# EAGLE design MacawBlue Thing Plus (EAGLE 9.6.2)

## Sheet 1 of 2
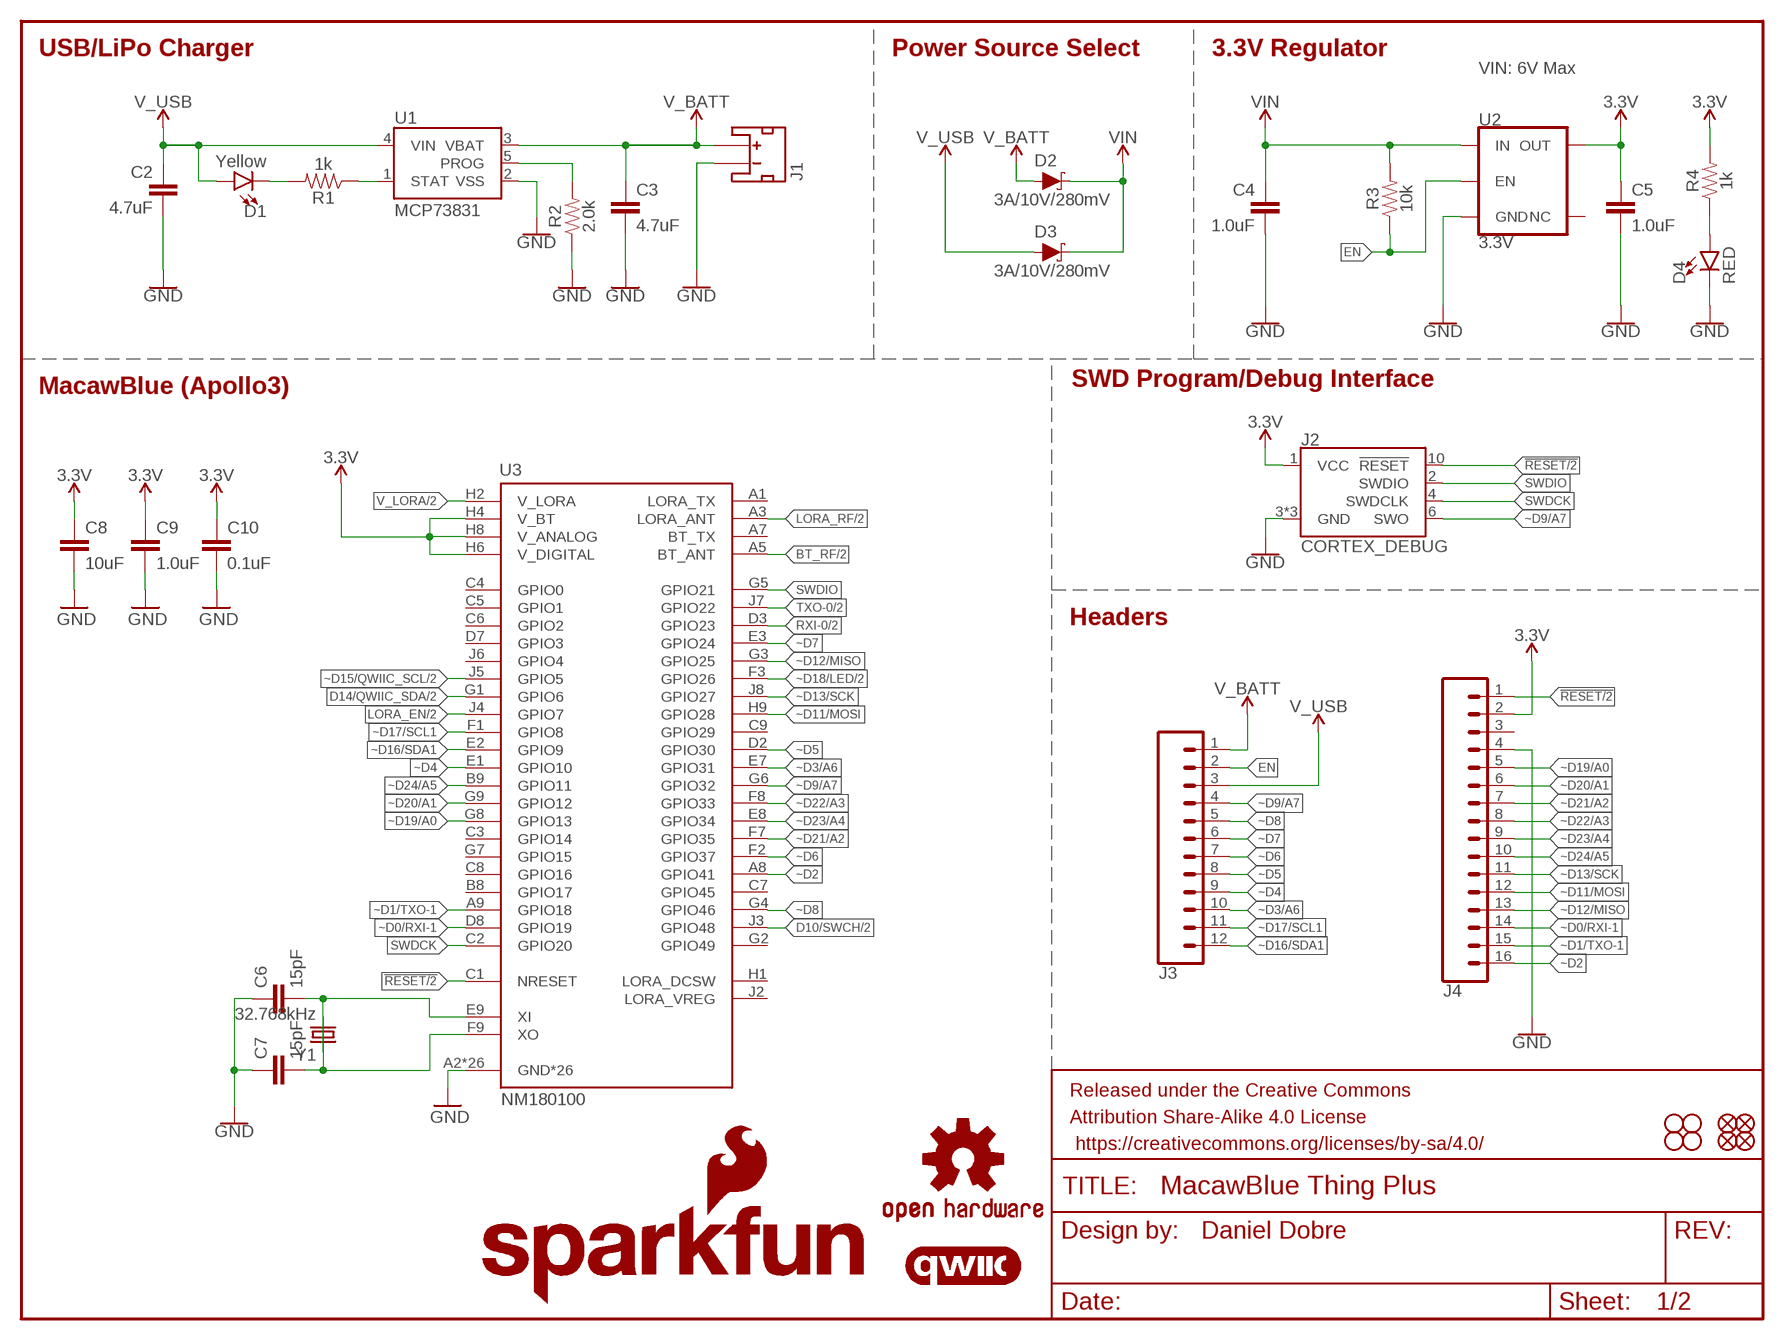
[diagram p0: schematic, sheet 1]

### Parts
C2  4.7uF  4.7UF-0603-6.3V-(10%)  [0603]
C3  4.7uF  4.7UF-0603-6.3V-(10%)  [0603]
C4  1.0uF  1.0UF-0402T-16V-10%  [0402-TIGHT]
C5  1.0uF  1.0UF-0402T-16V-10%  [0402-TIGHT]
C6  15pF  15PF-0603-50V-5%  [0603]
C7  15pF  15PF-0603-50V-5%  [0603]
C8  10uF  10UF-0603-6.3V-20%  [0603]
C9  1.0uF  1.0UF-0603-16V-10%  [0603]
C10  0.1uF  0.1UF-0603-25V-(+80/-20%)  [0603]
D1  Yellow  LED-YELLOW0603  [LED-0603]
D2  3A/10V/280mV  DIODE-SCHOTTKY-BAT60A  [SOD-323]
D3  3A/10V/280mV  DIODE-SCHOTTKY-BAT60A  [SOD-323]
D4  RED  LED-RED0603  [LED-0603]
FD1  FIDUCIALUFIDUCIAL  [FIDUCIAL-MICRO]
FD2  FIDUCIALUFIDUCIAL  [FIDUCIAL-MICRO]
FD3  FIDUCIALUFIDUCIAL  [FIDUCIAL-MICRO]
FD4  FIDUCIALUFIDUCIAL  [FIDUCIAL-MICRO]
FRAME1  FRAME-LETTER  [CREATIVE_COMMONS]
H1  STAND-OFF  [STAND-OFF]
H2  STAND-OFF  [STAND-OFF]
H3  STAND-OFF  [STAND-OFF]
H4  STAND-OFF  [STAND-OFF]
J1  JST_2MM_MALE  [JST-2-SMD]
J2  CORTEX_DEBUG  CORTEX_DEBUG_MINIMUM_PTH_NS  [2X5-PTH-1.27MM-NO_SILK]
J3  CONN_12SM_SQ_NO_SILK  [1X12_SM_SQ_NOSILK]
J4  CONN_161X16_SM_SQ_NOSILK  [1X16_SM_SQ_NOSILK]
LOGO1  OSHW-LOGOS  [OSHW-LOGO-S]
LOGO2  QWIIC_LOGO_5MM  [QWIIC_5MM]
LOGO3  SFE_LOGO_NAME_FLAME.1_INCH  [SFE_LOGO_NAME_FLAME_.1]
R1  1k  1KOHM-0603-1/10W-1%  [0603]
R2  2.0k  2.0KOHM-0603-1/10W-5%  [0603]
R3  10k  10KOHM-0603-1/10W-1%  [0603]
R4  1k  1KOHM-0603-1/10W-1%  [0603]
U1  MCP73831  [SOT23-5]
U2  3.3V  V_REG_AP2112K-3.3V  [SOT23-5]
U3  NM180100  [LGA81]
Y1  32.768kHz  CRYSTAL-32.768KHZSMD-3.2X1.5  [CRYSTAL-SMD-3.2X1.5MM]

### Nets
3.3V: C5.1 C8.1 C9.1 C10.1 J2.1(VCC) J4.2 R4.2 U2.5(OUT) U3.H4(V_BT) U3.H6(V_DIGITAL) U3.H8(V_ANALOG) ; also sheet 2
!RESET: J2.10(!RESET) J4.1 U3.C1(NRESET) ; also sheet 2
BT_RF: U3.A5(BT_ANT) ; also sheet 2
D10/SWCH: U3.J3(GPIO48) ; also sheet 2
D14/QWIIC_SDA: U3.G1(GPIO6) ; also sheet 2
EN: J3.2 R3.1 U2.3(EN)
GND: C2.2 C3.2 C4.2 C5.2 C6.1 C7.1 C8.2 C9.2 C10.2 D4.C J1.1(-) J2.3(GND) J2.5(GND) J2.9(GND) J4.4 R2.1 U1.2(VSS) U2.2(GND) U3.A2(GND*26) U3.A4(GND*26) U3.A6(GND*26) U3.B1(GND*26) U3.B2(GND*26) U3.B3(GND*26) U3.B4(GND*26) U3.B5(GND*26) U3.B6(GND*26) U3.B7(GND*26) U3.D1(GND*26) U3.D4(GND*26) U3.D5(GND*26) U3.D6(GND*26) U3.D9(GND*26) U3.E4(GND*26) U3.E5(GND*26) U3.E6(GND*26) U3.F4(GND*26) U3.F5(GND*26) U3.F6(GND*26) U3.H3(GND*26) U3.H5(GND*26) U3.H7(GND*26) U3.J1(GND*26) U3.J9(GND*26) ; also sheet 2
LORA_EN: U3.J4(GPIO7) ; also sheet 2
LORA_RF: U3.A3(LORA_ANT) ; also sheet 2
N$1: R2.2 U1.5(PROG)
N$2: C7.2 U3.F9(XO) Y1.P$2
N$3: D1.C R1.2
N$4: R1.1 U1.1(STAT)
N$8: C6.2 U3.E9(XI) Y1.P$1
N$10: D4.A R4.1
RXI-0: U3.D3(GPIO23) ; also sheet 2
SWDCK: J2.4(SWDCLK) U3.C2(GPIO20)
SWDIO: J2.2(SWDIO) U3.G5(GPIO21)
TXO-0: U3.J7(GPIO22) ; also sheet 2
V_BATT [power]: C3.1 D2.A J1.2(+) J3.1 U1.3(VBAT)
V_LORA: U3.H2(V_LORA) ; also sheet 2
V_USB: C2.1 D1.A D3.A J3.3 U1.4(VIN) ; also sheet 2
VIN: C4.1 D2.C D3.C R3.2 U2.1(IN) ; also sheet 2
~D0/RXI-1: J4.14 U3.D8(GPIO19)
~D1/TXO-1: J4.15 U3.A9(GPIO18)
~D2: J4.16 U3.A8(GPIO41)
~D3/A6: J3.10 U3.E7(GPIO31)
~D4: J3.9 U3.E1(GPIO10)
~D5: J3.8 U3.D2(GPIO30)
~D6: J3.7 U3.F2(GPIO37)
~D7: J3.6 U3.E3(GPIO24)
~D8: J3.5 U3.G4(GPIO46)
~D9/A7: J2.6(SWO) J3.4 U3.G6(GPIO32)
~D11/MOSI: J4.12 U3.H9(GPIO28)
~D12/MISO: J4.13 U3.G3(GPIO25)
~D13/SCK: J4.11 U3.J8(GPIO27)
~D15/QWIIC_SCL: U3.J5(GPIO5) ; also sheet 2
~D16/SDA1: J3.12 U3.E2(GPIO9)
~D17/SCL1: J3.11 U3.F1(GPIO8)
~D18/LED: U3.F3(GPIO26) ; also sheet 2
~D19/A0: J4.5 U3.G8(GPIO13)
~D20/A1: J4.6 U3.G9(GPIO12)
~D21/A2: J4.7 U3.F7(GPIO35)
~D22/A3: J4.8 U3.F8(GPIO33)
~D23/A4: J4.9 U3.E8(GPIO34)
~D24/A5: J4.10 U3.B9(GPIO11)
Unconnected: J1.NC1(PAD1) J1.NC2(PAD2) J4.3 U2.4(NC) U3.A1(LORA_TX) U3.A7(BT_TX) U3.B8(GPIO17) U3.C3(GPIO14) U3.C4(GPIO0) U3.C5(GPIO1) U3.C6(GPIO2) U3.C7(GPIO45) U3.C8(GPIO16) U3.C9(GPIO29) U3.D7(GPIO3) U3.G2(GPIO49) U3.G7(GPIO15) U3.H1(LORA_DCSW) U3.J2(LORA_VREG) U3.J6(GPIO4)

### Notes on the sheet
- USB/LiPo Charger | Power Source Select | 3.3V Regulator
- VIN: 6V Max
- MacawBlue (Apollo3) | SWD Program/Debug Interface
- Headers
- Daniel Dobre

## Sheet 2 of 2
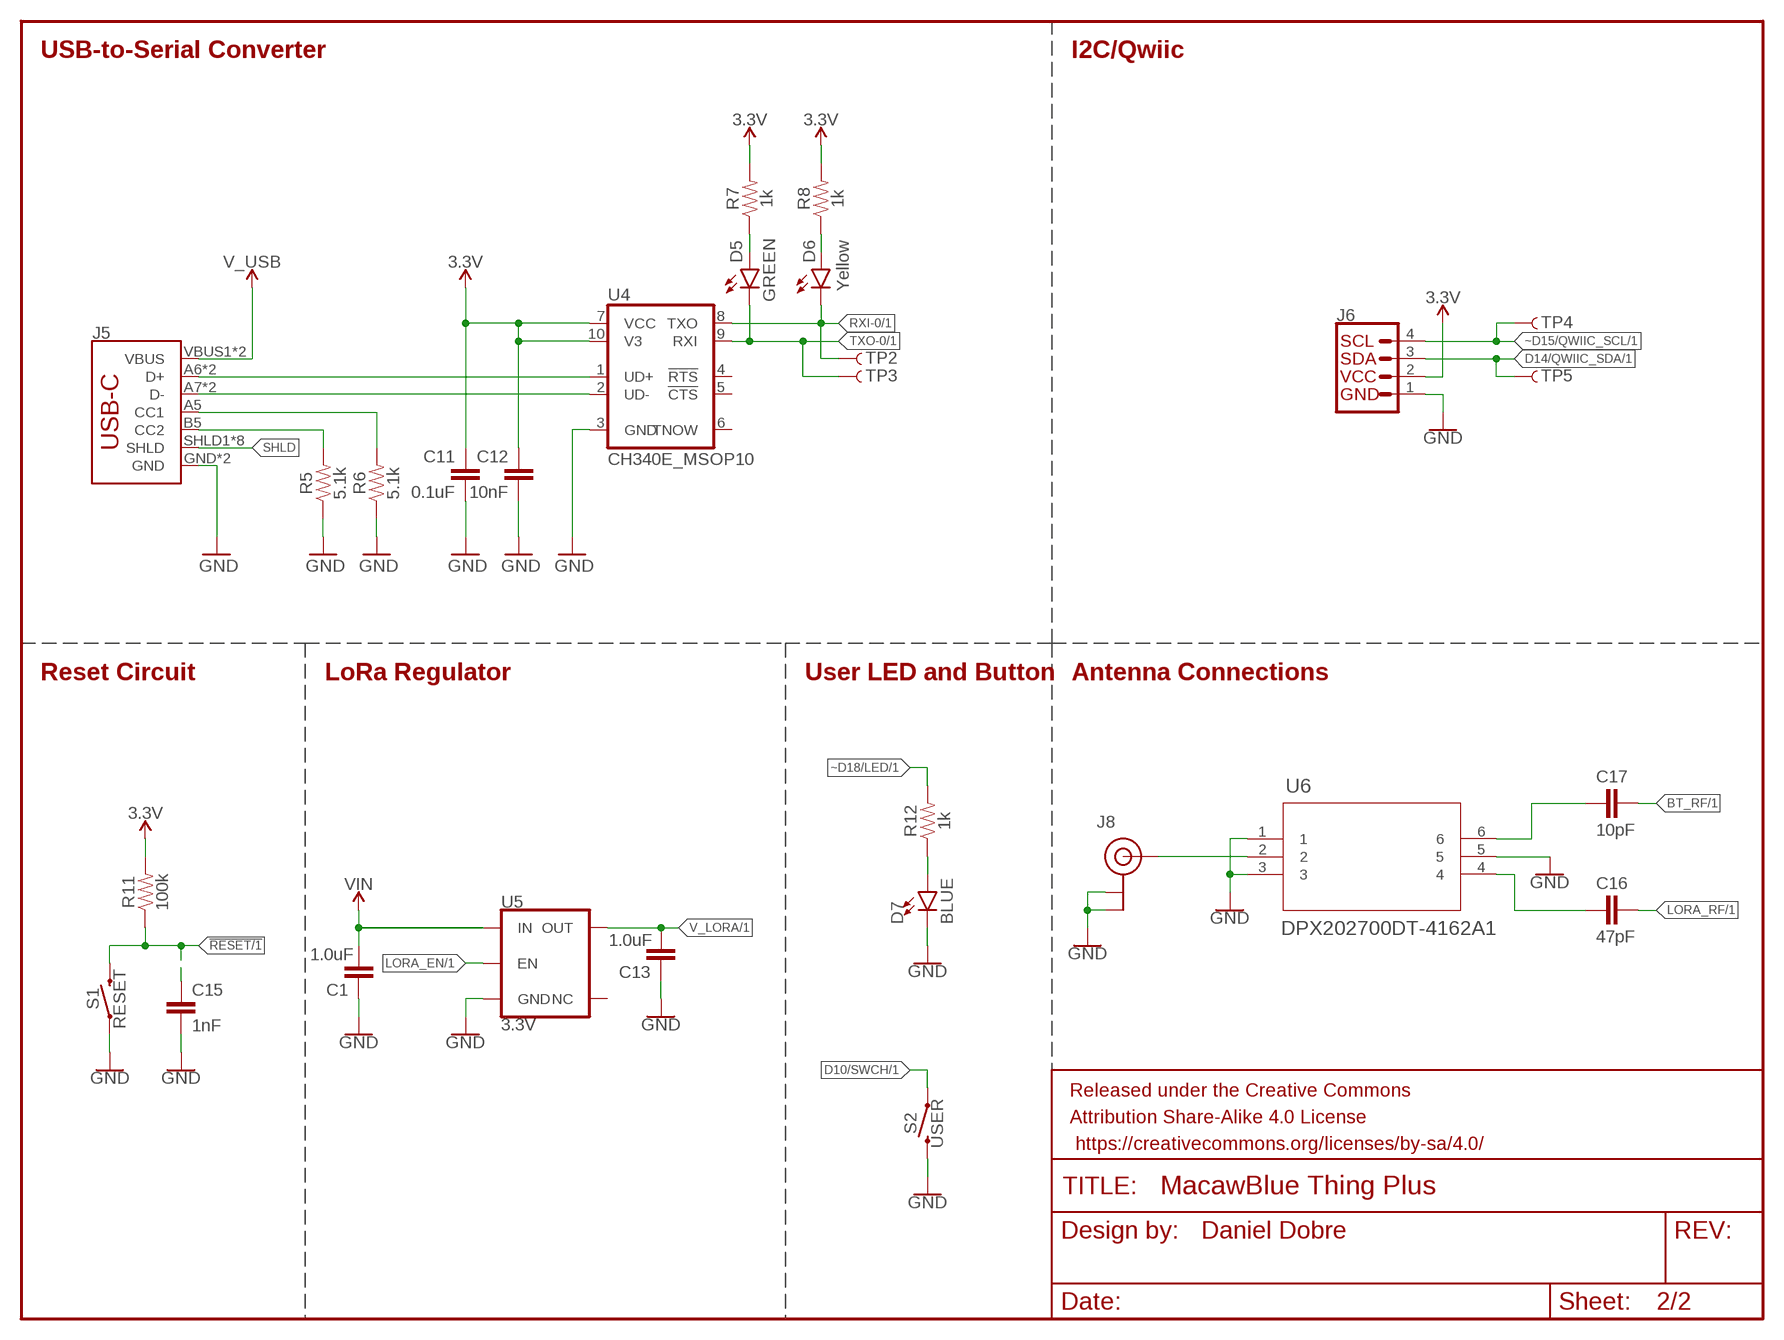
[diagram p1: schematic, sheet 2]

### Parts
C1  1.0uF  1.0UF-0402T-16V-10%  [0402-TIGHT]
C11  0.1uF  0.1UF-0603-25V-(+80/-20%)  [0603]
C12  10nF  10NF-0603-50V-10%  [0603]
C13  1.0uF  1.0UF-0402T-16V-10%  [0402-TIGHT]
C15  1nF  1.0NF/1000PF-0603-50V-10%  [0603]
C16  47pF  47PF-0603-50V-5%  [0603]
C17  10pF  10PF-0603-50V-5%  [0603]
D5  GREEN  LED-GREEN0603  [LED-0603]
D6  Yellow  LED-YELLOW0603  [LED-0603]
D7  BLUE  LED-BLUE0603  [LED-0603]
FRAME2  FRAME-LETTERNO_PACKAGE  [DUMMY]
J5  USB-C  USB_C2-LAYER  [USB-C-16P]
J6  QWIIC_CONNECTORJS-1MM  [JST04_1MM_RA]
J8  U.FL  [U.FL]
R5  5.1k  5.1KOHM5.1KOHM-0603-1/10W-1%  [0603]
R6  5.1k  5.1KOHM5.1KOHM-0603-1/10W-1%  [0603]
R7  1k  1KOHM-0603-1/10W-1%  [0603]
R8  1k  1KOHM-0603-1/10W-1%  [0603]
R11  100k  100KOHM-0603-1/10W-1%  [0603]
R12  1k  1KOHM-0603-1/10W-1%  [0603]
S1  RESET  MOMENTARY-SWITCH-SPST-SMD-4.6X2.8MM  [TACTILE_SWITCH_SMD_4.6X2.8MM]
S2  USER  MOMENTARY-SWITCH-SPST-SMD-4.6X2.8MM  [TACTILE_SWITCH_SMD_4.6X2.8MM]
TP2  TEST-POINTTP_15TH_THRU  [TP_15TH]
TP3  TEST-POINTTP_15TH_THRU  [TP_15TH]
TP4  TEST-POINTTP_15TH_THRU  [TP_15TH]
TP5  TEST-POINTTP_15TH_THRU  [TP_15TH]
U4  CH340E_MSOP10  [MSOP10]
U5  3.3V  V_REG_AP2112K-3.3V  [SOT23-5]
U6  DPX202700DT-4162A1  [RF_4060A1_TDK]

### Nets
3.3V: C11.1 C12.1 J6.2 R7.2 R8.2 R11.2 U4.7(VCC) U4.10(V3) ; also sheet 1
!RESET: C15.1 R11.1 S1.3 S1.4 ; also sheet 1
BT_RF: C17.1 ; also sheet 1
CC1: J5.A5(CC1) R6.2
CC2: J5.B5(CC2) R5.2
D10/SWCH: S2.1 S2.2 ; also sheet 1
D14/QWIIC_SDA: J6.3 TP5.P$1 ; also sheet 1
D+1: J5.A6(D+) J5.B6(D+) U4.1(UD+)
D-1: J5.A7(D-) J5.B7(D-) U4.2(UD-)
GND: C1.1 C11.2 C12.2 C13.1 C15.2 D7.C J5.GND J5.GND2(GND) J6.1 J8.1(GND) J8.2(GND) R5.1 R6.1 S1.1 S1.2 S2.3 S2.4 U4.3(GND) U5.2(GND) U6.1 U6.3 U6.5 ; also sheet 1
LORA_EN: U5.3(EN) ; also sheet 1
LORA_RF: C16.1 ; also sheet 1
N$5: D5.A R7.1
N$7: D7.A R12.1
N$9: D6.A R8.1
N$11: C17.2 U6.6
N$12: J8.FEED(SIGNAL) U6.2
N$13: C16.2 U6.4
RXI-0: D6.C TP2.P$1 U4.8(TXO) ; also sheet 1
SHLD: J5.SHLD1(SHLD) J5.SHLD2(SHLD) J5.SHLD3(SHLD) J5.SHLD4(SHLD) J5.SHLD5(SHLD) J5.SHLD6(SHLD) J5.SHLD7(SHLD) J5.SHLD8(SHLD)
TXO-0: D5.C TP3.P$1 U4.9(RXI) ; also sheet 1
V_LORA: C13.2 U5.5(OUT) ; also sheet 1
V_USB: J5.VBUS1(VBUS) J5.VBUS2(VBUS) ; also sheet 1
VIN: C1.2 U5.1(IN) ; also sheet 1
~D15/QWIIC_SCL: J6.4 TP4.P$1 ; also sheet 1
~D18/LED: R12.2 ; also sheet 1
Unconnected: U4.4(!RTS) U4.5(!CTS) U4.6(TNOW) U5.4(NC)

### Notes on the sheet
- USB-to-Serial Converter | I2C/Qwiic
- Reset Circuit | LoRa Regulator | User LED and Button | Antenna Connections
- Daniel Dobre

## Library data of the parts
C1 C4 C5 C13 = SparkFun-Capacitors:1.0UF: 1µF ceramic capacitors A capacitor is a passive two-terminal electrical component used to store electrical energy temporarily in an electric field.; PROD_ID: CAP-12417
C2 C3 = SparkFun-Capacitors:4.7UF: 4.7µF ceramic capacitors A capacitor is a passive two-terminal electrical component used to store electrical energy temporarily in an electric field.; PROD_ID: CAP-08280
C6 C7 = SparkFun-Capacitors:15PF: 15pF ceramic capacitors A capacitor is a passive two-terminal electrical component used to store electrical energy temporarily in an electric field.; PROD_ID: CAP-07881
C8 = SparkFun-Capacitors:10UF: 10.0µF ceramic capacitors A capacitor is a passive two-terminal electrical component used to store electrical energy temporarily in an electric field.; PROD_ID: CAP-11015
C9 = SparkFun-Capacitors:1.0UF: 1µF ceramic capacitors A capacitor is a passive two-terminal electrical component used to store electrical energy temporarily in an electric field.; PROD_ID: CAP-00868
C10 C11 = SparkFun-Capacitors:0.1UF: 0.1µF ceramic capacitors A capacitor is a passive two-terminal electrical component used to store electrical energy temporarily in an electric field.; PROD_ID: CAP-00810
C12 = SparkFun-Capacitors:10NF: 0.01uF/10nF/10,000pF ceramic capacitors A capacitor is a passive two-terminal electrical component used to store electrical energy temporarily in an electric field. CAP-09321; PROD_ID: CAP-00867
C15 = SparkFun-Capacitors:1.0NF/1000PF: 1nF/1,000pF ceramic capacitors A capacitor is a passive two-terminal electrical component used to store electrical energy temporarily in an electric field.; PROD_ID: CAP-07886
C16 = SparkFun-Capacitors:47PF: 47pF ceramic capacitors A capacitor is a passive two-terminal electrical component used to store electrical energy temporarily in an electric field.; PROD_ID: CAP-08913
C17 = SparkFun-Capacitors:10PF: 10pF ceramic capacitors A capacitor is a passive two-terminal electrical component used to store electrical energy temporarily in an electric field.; PROD_ID: CAP-11812
D1 D6 = SparkFun-LED:LED-YELLOW: Yellow SMD LED Used in manufacturing several products at SparkFun. Packages: 0603 - SMD 0603 package[Product Link] <http://www.kingbrightusa.com/product.asp?catalog_name=LED&product_id=APT1608SYCK> 0603 -SMART - SMART SMD 0603 package (more efficient/more expensive) [Product Link] <http://www.osram-os.com/osram_os/en/products/product-catalog/led-light-emitting-diodes/smartled-0603/ly-l29k/index.jsp> LilyPad - SMD1206 package[Product Datasheet] <https://www.sparkfun.com/datasheets/DevTools/LilyPad/Q150YUS4.pdf> SparkFun Products: Blynk Board <https://www.sparkfun.com/products/13794> IOIO-OTG <https://www.sparkfun.com/products/13613> XBee Explorer Serial <https://www.sparkfun.com/products/13225>; PROD_ID: DIO-09003
D2 D3 = SparkFun-DiscreteSemi:DIODE-SCHOTTKY: Schottky diode A Schottky diode is a semiconductor diode which has a low forward voltage drop and a very fast switching action.; PROD_ID: DIO-14072
D4 = SparkFun-LED:LED-RED: Red SMD LED Used in manufacturing of most products at SparkFun Packages: 0603 - SMD 0603 package [Product Link] <http://docs.avagotech.com/docs/AV02-0551EN> 0603 SMART - SMD 0603 SMART package ( more efficient and expensive)[Product Link] <http://www.osram-os.com/Graphics/XPic2/00077099_0.pdf> 1206 - SMD1206 package [Product Link] <https://www.sparkfun.com/datasheets/DevTools/LilyPad/Q150OVS4.pdff> SparkFun Products: Pro Mini 328 -5V <https://www.sparkfun.com/products/821> RedBoard <https://www.sparkfun.com/products/12757> IOIO-OTG <https://www.sparkfun.com/products/13613>; PROD_ID: DIO-00819
D5 = SparkFun-LED:LED-GREEN: Green SMD LED Used in manufacturing of various products at SparkFun Packages: 0603 - SMD 0603 package [Product Link] <http://www.futureelectronics.com/en/technologies/semiconductors/optoelectronics/leds/Pages/9894312-LTST-C190GKT.aspx?CrossPart=HSMG-C190&IM=0> LilyPad 1206 - SMD1206 LilyPad package [Product Link] <http://www.futureelectronics.com/en/Technologies/Product.aspx?ProductID=IN150NGHARVATEKCORPORATION2049943&IM=0> 1206 - SMD1206 package [Product Link] <http://www.futureelectronics.com/en/technologies/semiconductors/optoelectronics/leds/Pages/8315665-LTST-C150KGKT.aspx?IM=0> 1206 Bottom Mount -SMD 1206 Bottom Mount [Product Link] <http://www.digikey.com/product-detail/en/lite-on-inc/LTST-C230KGKT/160-1456-1-ND/386854> SparkFun Products: Pro Mini 328 -5V <https://www.sparkfun.com/products/821> RedBoard <https://www.sparkfun.com/products/12757> MP3 Trigger <https://www.sparkfun.com/products/13720> Makey Makey <https://www.sparkfun.com/products/11076>; PROD_ID: DIO-00821
D7 = SparkFun-LED:LED-BLUE: Blue SMD LED Used in manufacturing of various products at SparkFun Packages: 0603 - SMD 0603 package [Product Link] <http://www.digikey.com/product-detail/en/SMLE12BC7TT86/511-1589-2-ND/1641808> 1206 - SMD1206 package [Product Link] <http://www.digikey.com/product-detail/en/lite-on-inc/LTST-C150TBKT/160-1643-1-ND/573584> SparkFun Products: ESP8266 Thing-Dev Board <https://www.sparkfun.com/products/13711> RedBoard <https://www.sparkfun.com/products/12757>; PROD_ID: DIO-08575
FD1-FD4 = SparkFun-Aesthetics:FIDUCIAL: Fiducial Alignment Points Point-of-reference for pick-and-place machines and other optical instruments.
FRAME1 = SparkFun-Aesthetics:FRAME-LETTER: Schematic Frame - Letter Standard 8.5x11 US Letter frame
FRAME2 = SparkFun-Aesthetics:FRAME-LETTER: Schematic Frame - Letter Standard 8.5x11 US Letter frame; DESIGNER: Nobody; VERSION: v01
H1-H4 = SparkFun-Hardware:STAND-OFF: Stand Off Drill holes for mechanically mounting via screws, standoffs, etc. Note: Use the keepout ring to avoid running the screw head into surrounding components. Variant Overviews STAND-OFF - Mechanical footprint for a #4 phillips button head screw. STAND-OFF-TIGHT - Mechanical footprint for a #4 phillips button head screw, Example SparkFun Products Screw - Phillips Head (1/4", 4-40, 10 pack) <https://www.sparkfun.com/products/10453> (PRT-10453) Screw - Phillips Head (1/2", 4-40, 10 pack) <https://www.sparkfun.com/products/10452> (PRT-10452) Screw - Phillips Head (3/4", 4-40, 10 pack) <https://www.sparkfun.com/products/10451> (PRT-10451) Screw - Phillips Head (1", 4-40, 10 pack) <https://www.sparkfun.com/products/10450> (PRT-10450)
J1 = SparkFun-Connectors:JST_2MM_MALE: JST 2MM MALE RA CONNECTOR Two pin, compact surface mount connector. Commonly used as a battery input connection point. We really like the solid locking feeling and high current rating on these small connectors. We use these all the time as battery connectors. Mates to single-cell LiPo batteries. Here is the connector we sell at SparkFun: JST Right Angle Connector - White <https://www.sparkfun.com/products/8612> (PRT-08612) Datasheet <http://www.sparkfun.com/datasheets/Prototyping/Connectors/JST-Horizontal.pdf> It was used on these SparkFun products: SparkFun MOSFET Power Controller <https://www.sparkfun.com/products/11214> (PRT-11214) SparkFun Battery Babysitter - LiPo Battery Manager <https://www.sparkfun.com/products/13777> (PRT-13777) And many, many others that required a lipo battery connection.; PROD_ID: CONN-11443; SF_ID: PRT-08612
J2 = SparkFun-Connectors:CORTEX_DEBUG_MINIMUM: Cortex Debug Connector - 10 pin Supports JTAG debug, Serial Wire debug, and Serial Wire Viewer. PTH and SMD connector options available. General Connector Information <http://infocenter.arm.com/help/topic/com.arm.doc.faqs/attached/13634/cortex_debug_connectors.pdf> Products: PTH Connector <http://www.digikey.com/product-detail/en/cnc-tech/3220-10-0100-00/1175-1627-ND/3883661> -via Digi-Key SparkFun PSoc <https://www.sparkfun.com/products/13229> SparkFun T <https://www.sparkfun.com/products/13810>
J3 = SparkFun-Connectors:CONN_12: Multi connection point. Often used as Generic Header-pin footprint for 0.1 inch spaced/style header connections On any of the 0.1 inch spaced packages, you can populate with these: Break Away Headers - Straight <https://www.sparkfun.com/products/116> (PRT-00116) Break Away Male Headers - Right Angle <https://www.sparkfun.com/products/553> (PRT-00553) Female Headers <https://www.sparkfun.com/products/115> (PRT-00115) Break Away Headers - Machine Pin <https://www.sparkfun.com/products/117> (PRT-00117) Break Away Female Headers - Swiss Machine Pin <https://www.sparkfun.com/products/743> (PRT-00743) For SCREWTERMINALS and SPRING TERMINALS visit here: Screw Terimnals on SparkFun.com <https://www.sparkfun.com/search/results?term=Screw+Terminals> (5mm/3.5mm/2.54mm spacing) This device is also useful as a general connection point to wire up your design to another part of your project. Our various solder wires solder well into these plated through hole pads. Hook-Up Wire - Assortment (Stranded, 22 AWG) <https://www.sparkfun.com/products/11375> (PRT-11375) Hook-Up Wire - Assortment (Solid Core, 22 AWG) <https://www.sparkfun.com/products/11367> (PRT-11367) View the entire wire category on our website here <https://www.sparkfun.com/categories/141> Special notes: Molex polarized connector foot print use with SKU : PRT-08231 with associated crimp pins and housings. 1MM SMD Version SKU: PRT-10208 NOTES ON THE VARIANTS LOCK and LOCK_LONGPADS... This footprint was designed to help hold the alignment of a through-hole component (i.e. 6-pin header) while soldering it into place. You may notice that each hole has been shifted either up or down by 0.005 of an inch from it's more standard position (which is a perfectly straight line). This slight alteration caused the pins (the squares in the middle) to touch the edges of the holes. Because they are alternating, it causes a "brace" to hold the component in place. 0.005 has proven to be the perfect amount of "off-center" position when using our standard breakaway headers. Although looks a little odd when you look at the bare footprint, once you have a header in there, the alteration is very hard to notice. Also,if you push a header all the way into place, it is covered up entirely on the bottom side.
J4 = SparkFun-Connectors:CONN_16: Multi connection point. Often used as Generic Header-pin footprint for 0.1 inch spaced/style header connections On any of the 0.1 inch spaced packages, you can populate with these: Break Away Headers - Straight <https://www.sparkfun.com/products/116> (PRT-00116) Break Away Male Headers - Right Angle <https://www.sparkfun.com/products/553> (PRT-00553) Female Headers <https://www.sparkfun.com/products/115> (PRT-00115) Break Away Headers - Machine Pin <https://www.sparkfun.com/products/117> (PRT-00117) Break Away Female Headers - Swiss Machine Pin <https://www.sparkfun.com/products/743> (PRT-00743) For SCREWTERMINALS and SPRING TERMINALS visit here: Screw Terimnals on SparkFun.com <https://www.sparkfun.com/search/results?term=Screw+Terminals> (5mm/3.5mm/2.54mm spacing) This device is also useful as a general connection point to wire up your design to another part of your project. Our various solder wires solder well into these plated through hole pads. Hook-Up Wire - Assortment (Stranded, 22 AWG) <https://www.sparkfun.com/products/11375> (PRT-11375) Hook-Up Wire - Assortment (Solid Core, 22 AWG) <https://www.sparkfun.com/products/11367> (PRT-11367) View the entire wire category on our website here <https://www.sparkfun.com/categories/141> Special notes: Molex polarized connector foot print use with SKU : PRT-08231 with associated crimp pins and housings. 1MM SMD Version SKU: PRT-10208 NOTES ON THE VARIANTS LOCK and LOCK_LONGPADS... This footprint was designed to help hold the alignment of a through-hole component (i.e. 6-pin header) while soldering it into place. You may notice that each hole has been shifted either up or down by 0.005 of an inch from it's more standard position (which is a perfectly straight line). This slight alteration caused the pins (the squares in the middle) to touch the edges of the holes. Because they are alternating, it causes a "brace" to hold the component in place. 0.005 has proven to be the perfect amount of "off-center" position when using our standard breakaway headers. Although looks a little odd when you look at the bare footprint, once you have a header in there, the alteration is very hard to notice. Also,if you push a header all the way into place, it is covered up entirely on the bottom side.
J5 = SparkFun-Connectors:USB_C: USB Type C 16Pin Connector Super Speed pins not available on the 16-pin purely SMD connector so this part is best for USB 2.0 implementations. D1 and D2 are tied together enabling D+/- no matter which way the cable is plugged into the connector. The two channel configuration pins (CC1/2) are exposed. These are normally connected to ground via 5.1k resistors but can be reconfigured for high current/high power applications.; PROD_ID: CONN-14122
J6 = SparkFun-Connectors:QWIIC_CONNECTOR: SparkFun I2C Standard Qwiic Connector An SMD 1mm pitch JST connector makes it easy and quick (get it? Qwiic?) to connect I2C devices to each other. The Qwiic system <http://www.sparkfun.com/qwiic> enables fast and solderless connection between popular platforms and various sensors and actuators. We carry 200mm <https://www.sparkfun.com/products/14204>, 100mm <https://www.sparkfun.com/products/14205>, 50mm <https://www.sparkfun.com/products/14206>, and breadboard friendly <https://www.sparkfun.com/products/14207> Qwiic cables. We also offer 10 pcs strips <https://www.sparkfun.com/products/14323> the SMD connectors.; PROD_ID: CONN-13694
J8 = SparkFun-Connectors:U.FL: SMD Antenna Connector - U.FL 2mm height, 3.0mm x 3.0mm receptacle size. SparkFun Products: SparkFun WiFi Shield - ESP8266 <https://www.sparkfun.com/products/13287> SparkFun ESP8266 Thing <https://www.sparkfun.com/products/13231> SparkFun MiniGen - Pro Mini Signal Generator Shield <https://www.sparkfun.com/products/11420>; PROD_ID: CONN-09193; SF_ID: WRL-09144
LOGO1 = SparkFun-Aesthetics:OSHW-LOGO: Open-Source Hardware (OSHW) Logo This logo indicates the piece of hardware it is found on incorporates a OSHW license and/or adheres to the definition of open source hardware found here: http://freedomdefined.org/OSHW
LOGO2 = SparkFun-Aesthetics:QWIIC_LOGO: Qwiic Logos for placement on schematic and PCB. The 5.5mm silk logo is best for placing next to Qwiic connector.
LOGO3 = SparkFun-Aesthetics:SFE_LOGO_NAME_FLAME: SparkFun Font Logo w/ Flame This is the SparkFun full logo. The logo on the schematic will always be the same size; the package variant is the height of the flame part of the logo. Default layer for the logo on the board is tSilk.
R1 R4 R7 R8 R12 = SparkFun-Resistors:1KOHM: 1kΩ resistor A resistor is a passive two-terminal electrical component that implements electrical resistance as a circuit element. Resistors act to reduce current flow, and, at the same time, act to lower voltage levels within circuits. - Wikipedia; PROD_ID: RES-07856
R2 = SparkFun-Resistors:2.0KOHM: 2kΩ resistor A resistor is a passive two-terminal electrical component that implements electrical resistance as a circuit element. Resistors act to reduce current flow, and, at the same time, act to lower voltage levels within circuits. - Wikipedia; PROD_ID: RES-08296
R3 = SparkFun-Resistors:10KOHM: 10kΩ resistor A resistor is a passive two-terminal electrical component that implements electrical resistance as a circuit element. Resistors act to reduce current flow, and, at the same time, act to lower voltage levels within circuits. - Wikipedia; PROD_ID: RES-00824
R5 R6 = SparkFun-Resistors:5.1KOHM; PROD_ID: RES-12083
R11 = SparkFun-Resistors:100KOHM: 100kΩ resistor A resistor is a passive two-terminal electrical component that implements electrical resistance as a circuit element. Resistors act to reduce current flow, and, at the same time, act to lower voltage levels within circuits. - Wikipedia; PROD_ID: RES-07828
S1 S2 = SparkFun-Switches:MOMENTARY-SWITCH-SPST: Momentary Switch (Pushbutton) - SPST Normally-open (NO) SPST momentary switches (buttons, pushbuttons). Variants PTH-12MM - 12mm square, through-hole Momentary Pushbutton Switch - 12mm Square <https://www.sparkfun.com/products/9190> (COM-09190) PTH-6.0MM, PTH-6.0MM-KIT - 6.0mm square, through-hole Mini Pushbutton Switch <https://www.sparkfun.com/products/97> (COM-00097) KIT package intended for soldering kit's - only one side of pads' copper is exposed. PTH-RIGHT-ANGLE-KIT - Right-angle, through-hole Right Angle Tactile Button <https://www.sparkfun.com/products/10791> - Used on SparkFun BigTime Watch Kit <https://www.sparkfun.com/products/11734> SMD-12MM - 12mm square, surface-mount Tactile Button - SMD (12mm) <https://www.sparkfun.com/products/12993> (COM-12993) Used on SparkFun PicoBoard <https://www.sparkfun.com/products/11888> SMD-4.5MM - 4.5mm Square Trackball Switch Used on SparkFun Blackberry Trackballer Breakout <https://www.sparkfun.com/products/13169> SMD-4.6MMX2.8MM - 4.60mm x 2.80mm, surface mount Used on SparkFun SAMD21 Mini Breakout <https://www.sparkfun.com/products/13664> SMD-5.2MM, SMD-5.2-REDUNDANT - 5.2mm square, surface-mount Mini Pushbutton Switch - SMD <https://www.sparkfun.com/products/8720> (COM-08720) Used on Arduino Pro Mini <https://www.sparkfun.com/products/11114> REDUNDANT package connects both switch circuits together SMD-6.0X3.5MM - 6.0 x 3.5mm, surface mount Momentary Reset Switch SMD <https://www.sparkfun.com/products/8229> (COM-08229) SMD-6.2MM-TALL - 6.2mm square, surface mount Tactile Button - SMD (6mm) <https://www.sparkfun.com/products/12992> Used on SparkFun Digital Sandbox <https://www.sparkfun.com/products/12651> SMD-RIGHT-ANGLE - Right-angle, surface mount Used on SparkFun Block for Intel® Edison - Arduino <https://www.sparkfun.com/products/13036>; PROD_ID: SWCH-13065
TP2-TP5 = SparkFun-Connectors:TEST-POINT: SparkFun Test Points Bare copper test points for troubleshooting or In-Circuit-Testing. These are used by our Production team for verifying production board runs using pogo-pins on test beds. SparkFun Products: SparkFun LSM9DS1 Breakout <https://www.sparkfun.com/products/13284> SparkFun PSOC <https://www.sparkfun.com/products/13714> SparkFun Load Cell Amplifier <https://www.sparkfun.com/products/13879>
U1 = SparkFun-IC-Power:MCP73831: MCP73831T Li-Ion, Li-Pol Controller Miniature single cell, fully integrated Li-Ion, Li-polymer charge management controller Datasheet <http://ww1.microchip.com/downloads/en/DeviceDoc/20001984g.pdf> SparkFun Products: SparkFun ESP32 Thing <https://www.sparkfun.com/products/13907> SparkFun 9DoF Razor IMU M0 <https://www.sparkfun.com/products/14001>; PROD_ID: IC-09995
U2 U5 = SparkFun-IC-Power:V_REG_AP2112: AP2112 - 600mA CMOS LDO Regulator w/ Enable The AP2112 is CMOS process low dropout linear regulator with enable function, the regulator delivers a guaranteed 600mA (min.) continuous load current. Features Output Voltage Accuracy: ±1.5% Output Current: 600mA (Min.) Foldback Short Current Protection: 50mA Enable Function to Turn ON/OFF VOUT Low Dropout Voltage (3.3V): 250mV (Typ.) @IOUT=600mA Excellent Load Regulation: 0.2%/A (Typ.) Excellent Line Regulation: 0.02%/V (Typ.) Low Quiescent Current: 55μA (Typ.) Low Standby Current: 0.01μA (Typ.) Low Output Noise: 50μVRMS PSRR: 100Hz -65dB, 1kHz -65dB OTSD Protection Stable with 1.0μF Flexible Cap: Ceramic, Tantalum and Aluminum Electrolytic Operation Temperature Range: -40°C to 85°C ESD: MM 400V, HBM 4000V; PROD_ID: VREG-12457
U3 = JTD_Consulting:NM180100
U4 = SparkFun-IC-Comms:CH340E; PROD_ID: IC-14135
U6 = DPX202700DT:DPX202700DT-4162A1; BUILT_BY: EMA_Matt; COPYRIGHT: Copyright (C) 2018 Accelerated Designs. All rights reserved; MANUFACTURER_PART_NUMBER: DPX202700DT-4162A1; SOURCELIBRARY: TDK_2019-10-09; VENDOR: TDK
Y1 = SparkFun-Clocks:CRYSTAL-32.768KHZ: 32.768kHz Crystal Frequency: 32.768kHz Frequency Stability: ±20ppm Load Capacitance: 12.5pF (PTH-2X6 & SMD-3.2X1.5), 6pF (SMD-2X6) SparkFun Products: SparkFun BigTime Watch Kit <https://www.sparkfun.com/products/11734> SparkFun nRF52832 Breakout <https://www.sparkfun.com/products/13990> SparkFun Real Time Clock Module <https://www.sparkfun.com/products/12708>; PROD_ID: XTAL-13062

## Net classes
1 power: width 0.762 mm

## Board
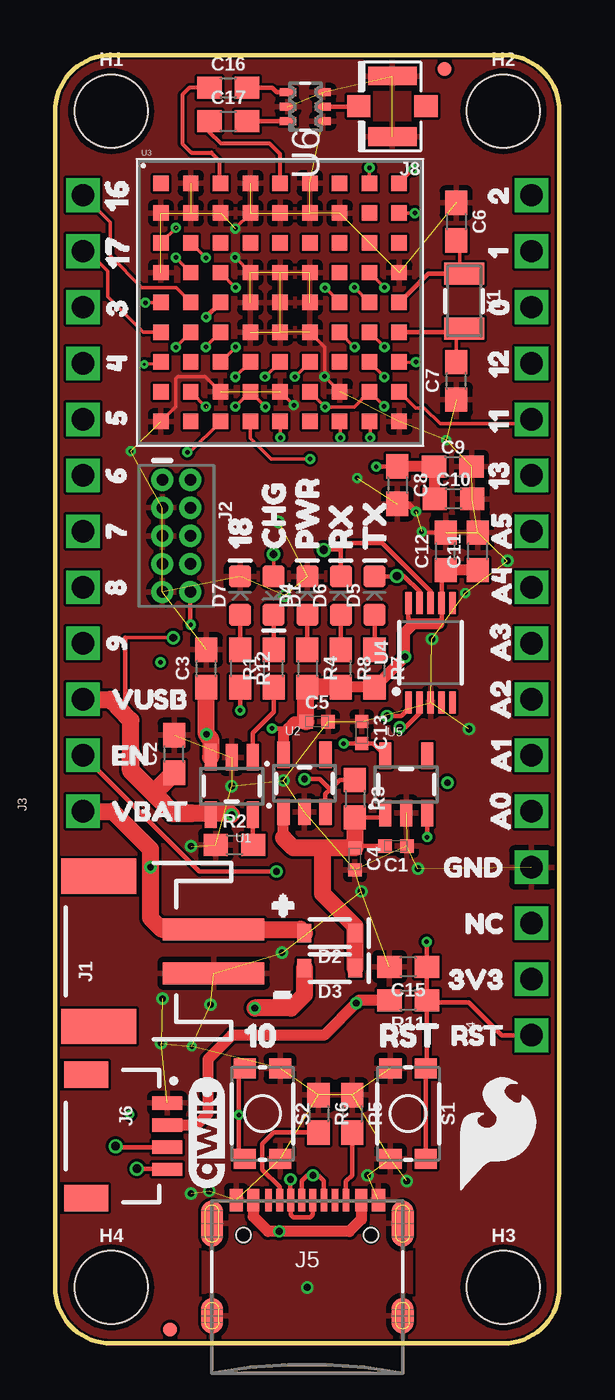
[diagram p2: board, top side]
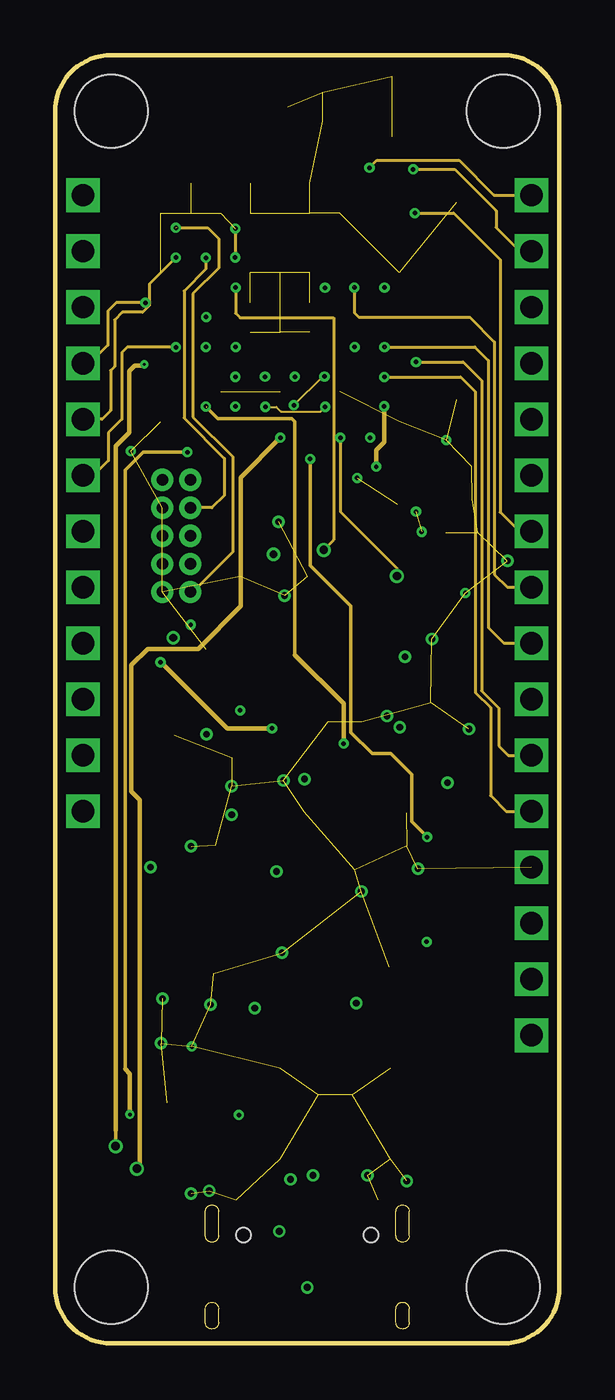
[diagram p3: board, inner layer Route2]
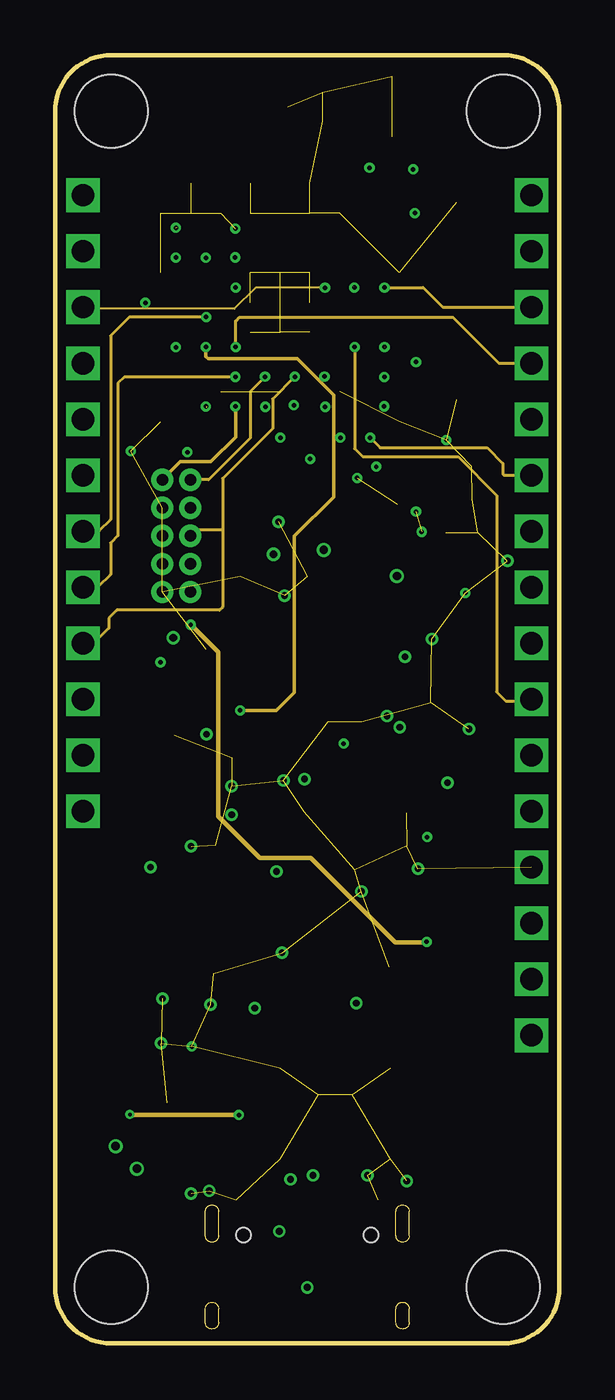
[diagram p4: board, inner layer Route15]
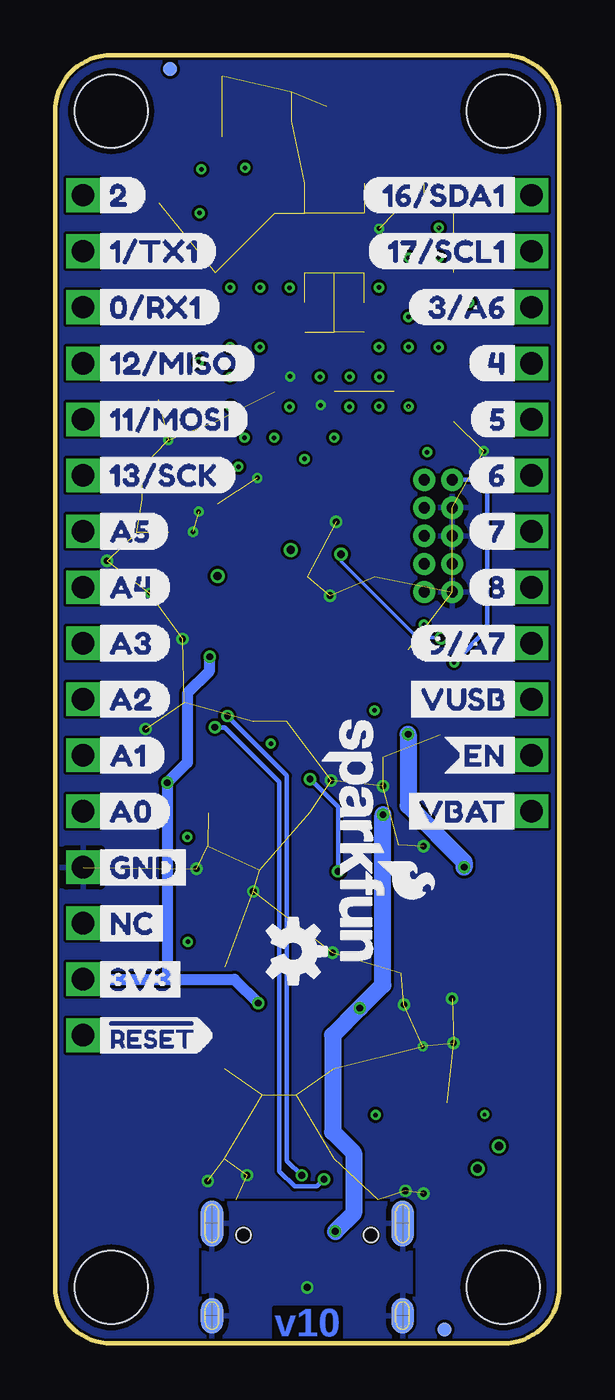
[diagram p5: board, bottom side, seen from below]

Size 22.86 x 58.42 mm. Coordinates in mm from the lower left corner, seen from the top.
Outline: 0,55.88 0,2.54 arc90 2.54,0 20.32,0 arc90 22.86,2.54 22.86,55.88 arc90 20.32,58.42 2.54,58.42 arc90 0,55.88
Copper layers (1*2*15*16): Top 0.035559375mm / dielectric 0.47751875mm / Route2 0.035559375mm / dielectric 0.47751875mm / Route15 0.035559375mm / dielectric 0.47751875mm / Bottom 0.035559375mm
Design rules "SparkFun-4-layer-FAB-LIMIT": minimum track width 4mil, minimum drill 6mil, track to track 5mil, track to pad 5mil, pad to pad 5mil, via to via 5mil, smd to smd 5mil, copper to edge 4mil, drill to drill 4mil, minimum pad ring 5mil, minimum via ring 5mil, stop-mask expansion 4mil, vias tented up to drill 25mil, thermal gap 10mil

### Footprints (pad centres in the part's own frame; a part is rotated, then mirrored left to right if it is on the bottom)
0402-TIGHT = smd 0.6 x 0.6: 1 -0.5,0; 2 0.5,0
0603 = smd 1.1 x 1: 1 -0.85,0; 2 0.85,0
LED-0603 = smd 1 x 1: A -0.877,0; C 0.877,0
SOD-323 = smd 0.63 x 0.83: A 1.15,0; C -1.15,0
FIDUCIAL-MICRO = smd 0.635 x 0.635: 1 0,0
STAND-OFF = hole 3.302: 0,0
JST-2-SMD = smd 1 x 4.6: 1 -1,-3.7; 2 1,-3.7 | smd 1.6 x 3.4: NC1 -3.4,1.5; NC2 3.4,1.5
2X5-PTH-1.27MM-NO_SILK = drill 0.508 pad 1: 1 -2.54,-0.635; 2 -2.54,0.635; 3 -1.27,-0.635; 4 -1.27,0.635; 5 0,-0.635; 6 0,0.635; 7 1.27,-0.635; 8 1.27,0.635; 9 2.54,-0.635; 10 2.54,0.635
1X12_SM_SQ_NOSILK = drill 1.016 pad 1.27 square: 1 0,0; 2 2.54,0; 3 5.08,0; 4 7.62,0; 5 10.16,0; 6 12.7,0; 7 15.24,0; 8 17.78,0; 9 20.32,0; 10 22.86,0; 11 25.4,0; 12 27.94,0
1X16_SM_SQ_NOSILK = drill 1.016 pad 1.27 square: 1 0,0; 2 2.54,0; 3 5.08,0; 4 7.62,0; 5 10.16,0; 6 12.7,0; 7 15.24,0; 8 17.78,0; 9 20.32,0; 10 22.86,0; 11 25.4,0; 12 27.94,0; 13 30.48,0; 14 33.02,0; 15 35.56,0; 16 38.1,0
USB-C-16P = smd 0.3 x 1.016: A5 -1.25,0.154; A6 -0.25,0.154; A7 0.25,0.154; A8 1.25,0.154; B5 1.75,0.154; B6 0.75,0.154; B7 -0.75,0.154; B8 -1.75,0.154 | smd 0.6 x 1.016: GND -3.225,0.154; GND2 3.225,0.154 | smd 1 x 2.1: SHLD1 -4.32,-0.915; SHLD2 4.32,-0.915 | smd 1 x 2.1 bottom: SHLD3 -4.32,-0.915; SHLD4 4.32,-0.915 | smd 1 x 1.6: SHLD5 -4.32,-5.095; SHLD8 4.32,-5.095 | smd 1 x 1.6 bottom: SHLD6 -4.32,-5.095; SHLD7 4.32,-5.095 | smd 0.55 x 1.016: VBUS1 -2.45,0.154; VBUS2 2.45,0.154 | hole 0.65: -2.89,-1.445; 2.89,-1.445
JST04_1MM_RA = smd 0.6 x 1.35: 1 -1.5,0; 2 -0.5,0; 3 0.5,0; 4 1.5,0 | smd 1.2 x 2: NC1 2.8,-3.675; NC2 -2.8,-3.675
U.FL = smd 2.2 x 0.85: 1 0,1.375; 2 0,-1.375 | smd 1.05 x 1: FEED 1.525,0; NC -1.525,0
TACTILE_SWITCH_SMD_4.6X2.8MM = smd 0.9 x 1: 1 -2.05,-0.8; 2 2.05,-0.8; 3 2.05,0.8; 4 -2.05,0.8
TP_15TH = drill 0.381 pad 0.61: P$1 0,0
SOT23-5 = smd 0.55 x 1.2: 1 -0.95,-1.3; 2 0,-1.3; 3 0.95,-1.3; 4 0.95,1.3; 5 -0.95,1.3
LGA81 = smd 0.7 x 0.7: A1 -5.4,5.4; A2 -4.05,5.4; A3 -2.7,5.4; A4 -1.35,5.4; A5 0,5.4; A6 1.35,5.4; A7 2.7,5.4; A8 4.05,5.4; A9 5.4,5.4; B1 -5.4,4.05; B2 -4.05,4.05; B3 -2.7,4.05; B4 -1.35,4.05; B5 0,4.05; B6 1.35,4.05; B7 2.7,4.05; B8 4.05,4.05; B9 5.4,4.05; C1 -5.4,2.7; C2 -4.05,2.7; C3 -2.7,2.7; C4 -1.35,2.7; C5 0,2.7; C6 1.35,2.7; C7 2.7,2.7; C8 4.05,2.7; C9 5.4,2.7; D1 -5.4,1.35; D2 -4.05,1.35; D3 -2.7,1.35; D4 -1.35,1.35; D5 0,1.35; D6 1.35,1.35; D7 2.7,1.35; D8 4.05,1.35; D9 5.4,1.35; E1 -5.4,0; E2 -4.05,0; E3 -2.7,0; E4 -1.35,0; E5 0,0; E6 1.35,0; E7 2.7,0; E8 4.05,0; E9 5.4,0; F1 -5.4,-1.35; F2 -4.05,-1.35; F3 -2.7,-1.35; F4 -1.35,-1.35; F5 0,-1.35; F6 1.35,-1.35; F7 2.7,-1.35; F8 4.05,-1.35; F9 5.4,-1.35; G1 -5.4,-2.7; G2 -4.05,-2.7; G3 -2.7,-2.7; G4 -1.35,-2.7; G5 0,-2.7; G6 1.35,-2.7; G7 2.7,-2.7; G8 4.05,-2.7; G9 5.4,-2.7; H1 -5.4,-4.05; H2 -4.05,-4.05; H3 -2.7,-4.05; H4 -1.35,-4.05; H5 0,-4.05; H6 1.35,-4.05; H7 2.7,-4.05; H8 4.05,-4.05; H9 5.4,-4.05; J1 -5.4,-5.4; J2 -4.05,-5.4; J3 -2.7,-5.4; J4 -1.35,-5.4; J5 0,-5.4; J6 1.35,-5.4; J7 2.7,-5.4; J8 4.05,-5.4; J9 5.4,-5.4
MSOP10 = smd 1 x 0.3: 1 -2.25,1; 2 -2.25,0.5; 3 -2.25,0; 4 -2.25,-0.5; 5 -2.25,-1; 6 2.25,-1; 7 2.25,-0.5; 8 2.25,0; 9 2.25,0.5; 10 2.25,1
RF_4060A1_TDK = smd 0.356 x 0.737: 1 -0.65,-0.787; 2 0,-0.787; 3 0.65,-0.787; 4 0.65,0.787; 5 0,0.787; 6 -0.65,0.787
CRYSTAL-SMD-3.2X1.5MM = smd 1 x 1.8: P$1 -1.25,0; P$2 1.25,0

### Placement (x,y rotation side)
C1  15.45,22.55 180 top
C2  5.4,26.73 90 top
C3  6.86,30.61 90 top
C4  13.59,21.97 270 top
C5  11.87,28.19 0 top
C6  18.17,50.87 270 top
C7  18.18,43.65 90 top
C8  15.52,38.92 270 top
C9  18.03,39.76 0 top
C10  18.05,38.3 0 top
C11  19.16,35.92 90 top
C12  17.7,35.92 90 top
C13  13.9,27.7 270 top
C15  16,17.08 180 top
C16  7.84,56.94 0 top
C17  7.84,55.42 0 top
D1  9.91,33.91 270 top
D2  12.45,18.61 180 top
D3  12.45,17.02 180 top
D4  11.43,33.91 90 top
D5  14.48,33.91 90 top
D6  12.95,33.91 90 top
D7  8.38,33.91 90 top
FD1  17.65,57.78 0 bottom
FD2  17.65,57.78 0 top
FD3  5.21,0.64 0 bottom
FD4  5.21,0.64 0 top
FRAME1  -12.7,-20.32 0 top  (outside the outline)
FRAME2  -12.7,-20.32 0 top  (outside the outline)
H1  2.54,55.88 0 top
H2  20.32,55.88 0 top
H3  20.32,2.54 0 top
H4  2.54,2.54 0 top
J1  3.48,17.78 90 top
J2  5.5,36.62 270 top
J3  1.27,24.13 90 top
J4  21.59,13.97 90 top
J5  11.43,6.35 0 top
J6  5.08,9.4 270 top
J8  15.28,56.1 180 top
LOGO1  12.06,17.78 270 bottom
LOGO2  6.86,9.53 90 top
LOGO3  10.86,28.7 270 bottom
R1  9.91,30.61 90 top
R2  8.13,22.61 0 top
R3  13.59,24.7 270 top
R4  11.43,30.61 270 top
R5  13.46,10.41 270 top
R6  11.94,10.41 270 top
R7  14.48,30.61 270 top
R8  12.95,30.61 270 top
R11  16,15.56 180 top
R12  8.38,30.61 270 top
S1  16,10.41 270 top
S2  9.4,10.41 270 top
TP2  12.18,35.98 0 top
TP3  15.49,34.8 0 top
TP4  3.71,7.92 0 top
TP5  2.74,8.94 0 top
U1  8,25.27 180 top
U2  11.3,25.4 0 top
U3  10.2,47.21 0 top
U4  17.02,31.32 90 top
U5  15.92,25.35 0 top
U6  11.34,56.08 90 top
U$1  [160]  2.77,50.46 90 top
U$2  [171]  2.82,47.87 90 top
U$3  [32]  2.79,45.75 90 top
U$4  [43]  2.79,43.28 90 top
U$5  [54]  2.77,40.83 90 top
U$6  [65]  2.74,38.2 90 top
U$7  [76]  2.77,35.55 90 top
U$8  [87]  2.74,32.96 90 top
U$9  [98]  2.79,30.61 90 top
U$10  [VUSB9]  1.78,29.21 0 top
U$11  [EN10]  1.78,26.67 0 top
U$12  [VBAT11]  1.78,24.13 0 top
U$13  [227]  20.09,50.86 90 top
U$14  [126]  20.07,48.41 90 top
U$15  [025]  20.12,45.81 90 top
U$16  [1123]  20.09,40.5 90 top
U$17  [1224]  20.09,42.81 90 top
U$18  [1322]  20.1,37.92 90 top
U$19  [A521]  20.22,35.23 90 top
U$20  [A420]  20.23,32.73 90 top
U$21  [A319]  20.18,30.14 90 top
U$22  [A218]  20.19,27.39 90 top
U$23  [A117]  20.21,25.12 90 top
U$24  [A016]  20.18,22.48 90 top
U$25  [GND13]  16.83,21.59 0 top
U$26  [NC12]  17.78,19.05 0 top
U$27  [3V314]  17.02,16.51 0 top
U$28  [RST15]  17.14,13.97 0 top
U$29  [184]  8.38,35.12 90 top
U$30  [CHG1]  9.91,35.12 90 top
U$31  [PWR2]  11.43,35.12 90 top
U$32  [RX3]  12.95,35.12 90 top
U$33  [TX4]  14.48,35.12 90 top
U$34  [20]  21.35,52.07 0 bottom
U$35  [1#TX11]  21.35,49.53 0 bottom
U$36  [0#RX12]  21.31,46.99 0 bottom
U$37  [12#MISO3]  21.31,44.45 0 bottom
U$38  [11#MOSI4]  21.34,41.91 0 bottom
U$39  [13#SCK5]  21.35,39.37 0 bottom
U$40  [A56]  21.31,36.83 0 bottom
U$41  [A47]  21.3,34.29 0 bottom
U$42  [A38]  21.34,31.75 0 bottom
U$43  [A29]  21.35,29.21 0 bottom
U$44  [A110]  21.3,26.67 0 bottom
U$45  [A011]  21.35,24.13 0 bottom
U$46  [GND12]  21.31,21.59 0 bottom
U$47  [NC13]  21.31,19.05 0 bottom
U$48  [3V314]  21.35,16.51 0 bottom
U$49  [#RESET15]  21.46,13.97 0 bottom
U$50  [16#SDA12]  8.95,52.07 0 bottom
U$51  [17#SCL13]  8.71,49.53 0 bottom
U$52  [412]  4.2,44.45 0 bottom
U$53  [513]  4.11,41.91 0 bottom
U$54  [614]  4.16,39.37 0 bottom
U$55  [715]  4.16,36.83 0 bottom
U$56  [816]  4.15,34.29 0 bottom
U$57  [9#A719]  6.79,31.75 0 bottom
U$58  [3#A60]  6.88,46.99 0 bottom
U$59  [VUSB25]  7.23,29.21 0 bottom
U$60  [EN26]  5.28,26.67 0 bottom
U$61  [VBAT27]  7.28,24.13 0 bottom
U$62  [100]  7.68,13.97 0 top
U$63  [RST1]  13.78,13.97 0 top
U$65  [SFE_LOGO_FLAME_.2]  18.05,6.69 0 top
U$67  [#0]  8.45,20.07 0 top
U$68  [#1]  8.45,16.13 0 top
Y1  18.55,47.27 270 top

### Tracks (layer width: path | path; a pad name or v marks a point on that pad's centre or on a via)
3.3V  (via drill 0.2, 0.2 layers 1-2, 0.3)
  Top 0.102: v9.53,42.48 v9.53,42.47
  Top 0.127: U3.H8 | v8.17,42.48 | v14.91,42.49
  Top 0.152: v14.91,42.49 U3.H8 13.56,42.47 v12.23,42.47 U3.H6 | v14.55,39.75 14.57,39.77 | v8.17,42.48 U3.H4 v9.53,42.48
  Top 0.203: v17.78,25.43 17.8,25.41 | 17.52,34.88 U4.7 17.52,32.64 17.4,32.64 | U4.10 16.02,32.88 16.26,32.64 | 14.57,39.77 C8.1 | 10.56,27.9 v9.84,27.9 v9.83,27.89
  Top 0.508: C8.1 C9.1 17.18,38.32 C10.1 | R8.2 R7.2 v15.86,31.13 15.86,32.24 16.26,32.64 17.4,32.64 | U2.5 10.35,27.69 10.56,27.9 10.86,28.19 C5.1 | C11.1 C12.1 17.52,34.88 | J6.2 6.41,9.9 6.92,10.41 6.92,12.89 8,13.97 12.19,13.97 v13.65,15.43 13.78,15.56 R11.2
  Top 0.762: R8.2 R4.2 11.37,29.7 C5.1
  Route2 0.102: v9.53,42.47 10.03,42.47 10.24,42.27 12.04,42.27 v12.24,42.47 v12.23,42.47
  Route2 0.203: v14.91,42.49 14.91,40.87 14.55,40.51 v14.55,39.75 | v9.83,27.89 7.8,27.89 4.8,30.89 v4.78,30.89
  Route15 0.127: 8.18,42.44 v8.18,42.47 v8.17,42.48
  Route15 0.152: J2.1 5.68,39.98 7.06,39.98 8.18,41.1 8.18,42.44
  Bottom 0.203: v4.78,30.89 3.28,32.38 3.28,38.58 3.86,39.16 J2.1
  Bottom 0.508: J4.2 17.78,16.51 | 17.78,16.51 14.73,16.51 v13.65,15.43 | 17.78,16.51 v17.78,25.43 16.87,26.34 16.87,29.48 15.86,30.5 v15.86,31.13
!RESET  (via drill 0.2)  (1 unrouted)
  Top 0.152: U3.C1 5.51,50.62
  Top 0.203: S1.3 S1.4 16.85,12.51 R11.1 | R11.1 C15.1 16.84,17.09 v16.84,18.21 | R11.1 16.94,15.47 18.75,15.47 20.24,13.97 J4.1 | J2.10 6.13,32.6 v6.15,32.59
  Route2 0.127: v5.47,50.59 6.92,50.59 7.42,50.09 7.42,48.77 6.25,47.6 6.25,42.01 8.05,40.21 8.05,35.89 6.24,34.08 J2.10
  Route15 0.203: v6.15,32.59 7.39,31.34 7.39,23.9 9.27,22.02 11.58,22.02 15.42,18.19 16.82,18.19 v16.84,18.21
BT_RF
  Top 0.178: U3.A5 10.2,53.94 | 10.2,53.94 10.19,53.95 | 10.2,53.94 9.73,54.41 7.92,54.41 7.52,54.41 7,54.93 C17.1
CC1
  Top 0.203: J5.A5 10.18,7.09 9.4,7.87 9.4,9.05 9.91,9.56 R6.2
CC2
  Top 0.203: R5.2 13.46,7.62 13.18,7.34 J5.B5
D10/SWCH  (via drill 0.15, 0.2)
  Top 0.152: U3.J3 6.1,40.41 v5.99,40.41 | S2.2 8.33,8.63
  Top 0.203: S2.2 8.34,8.62 | S2.1 8.32,12.19 8.32,10.38 v8.33,10.36 8.33,8.63
  Route2 0.152: v5.99,40.41 3.99,40.41 3.17,39.6 3.17,12.45
  Route2 0.203: v3.39,10.38 3.39,12.23 3.17,12.45
  Route15 0.203: v8.33,10.36 3.43,10.36 3.4,10.39 v3.39,10.38
D14/QWIIC_SDA  (via drill 0.13 layers 1-2)
  Top 0.127: U3.G1 4.69,44.4 v4.04,44.4
  Top 0.203: TP5.P$1 2.74,8.9 J6.3
  Route2 0.127: 3.99,44.35 v4.04,44.4
  Route2 0.152: 2.74,9.65 TP5.P$1
  Route2 0.203: 2.74,9.65 2.74,40.69 3.35,41.3 3.35,44.09 3.61,44.35 3.99,44.35
D+1  (via drill 0.3)
  Top 0.203: U4.1 16.02,28.78 15.68,28.45 v15.05,28.45 | J5.B6 12.18,7.38 11.94,7.62 v11.68,7.62 11.43,7.62 11.18,7.37 J5.A6
  Bottom 0.203: v15.05,28.45 12.35,25.75 12.35,8.29 v11.68,7.62
D-1  (via drill 0.3)
  Top 0.203: J5.A7 11.68,5.84 11.56,5.71 10.79,5.71 10.68,5.83 J5.B7 10.67,6.52 v10.67,7.44 | v15.62,27.94 15.88,27.94 16.52,28.58 U4.2
  Bottom 0.203: v15.62,27.94 15.18,27.94 12.7,25.46 12.7,7.81 12,7.11 11,7.11 v10.67,7.44
EN  (via drill 0.3)
  Top 0.203: U2.3 12.25,24.91 12.47,25.13 | 12.47,25.13 12.89,25.55 R3.1 | J3.2 6.54,21.4 v10.03,21.4 | v11.3,25.59 12,25.59 12.47,25.13
  Bottom 0.203: v10.03,21.4 10.03,24.32 v11.3,25.59
GND  (via drill 0.2, 0.2 pad 0.1, 0.3)  (84 unrouted)
  Top 0.102: U3.H3 | 10.81,42.55 v10.82,42.55 | 12.16,43.9 v12.21,43.85 | v12.22,43.85 v12.21,43.85 | v12.21,43.84 v12.21,43.85
  Top 0.127: v8.15,49.25 v8.16,49.24 | U3.B4 8.85,51.24
  Top 0.152: C12.2 16.65,36.77 v16.61,36.8 | U3.D4 v8.15,49.25 | 8.85,51.24 v8.17,50.56 v8.17,50.55 | U3.F6 12.22,45.19 v12.22,43.85 | U3.H3 6.81,43.84 5.56,43.84 5.47,43.74 5.47,42.48 U3.J1 | U3.H5 10.81,42.55 | U3.H7 v12.21,43.84
  Top 0.254: C8.2 16.01,38.07 v16.36,37.72
  Route2 0.102: v10.82,42.55 12.12,43.85 v12.21,43.85
  Route2 0.127: v8.17,50.55 8.17,49.26 v8.16,49.24
  other vias: 6.16,22.54 13.88,20.5 10.35,25.53 10.12,37.26 10.4,33.91 8,25.27 6.99,6.92 14.16,7.62 6.16,6.79 15.94,7.37 4.8,13.61 4.86,15.63 10.29,17.72 7.05,15.37 16.45,21.53 18.76,27.86 17.08,31.94 20.51,35.49 17.73,40.97 3.43,40.46 13.69,39.24 18.59,34.04 6.2,13.46
  pour Top (rank 2): 0,0 0,58.42 22.86,58.42 22.86,0
  pour Bottom (rank 2): 0,0 0,58.42 22.86,58.42 22.86,0
LORA_EN  (via drill 0.2)
  Top 0.152: U3.J4 8.85,41.05 9.79,40.11 v11.56,40.11 11.66,40.11 | v16.87,22.97 v16.87,22.96
  Top 0.203: U5.3 v16.87,22.97
  Route2 0.152: v16.87,22.96 16.15,23.67 16.15,25.81 15.21,26.75 14.38,26.75 13.41,27.71 13.41,33.43 11.56,35.28 v11.56,40.11
LORA_RF
  Top 0.178: 7.47,52.64 7.47,53.62 7.09,54 6.17,54 5.77,54.41 5.77,56.62 6.08,56.94 C16.1
  Top 0.203: U3.A3 7.47,52.64
N$1
  Top 0.203: U1.5 8.95,22.63 R2.2
N$2
  Top 0.152: Y1.P$2 18.38,45.86 18.16,45.86 18.18,45.83 C7.2
  Top 0.203: U3.F9 18.16,45.86
N$3
  Top 0.203: D1.C R1.2
N$4
  Top 0.203: U1.1 8.95,27.68 9.91,28.64 R1.1
N$5
  Top 0.203: D5.A R7.1
N$7
  Top 0.203: D7.A R12.1
N$8
  Top 0.152: Y1.P$1 18.34,48.52 18.34,49.86 C6.2
  Top 0.203: U3.E9 16.91,48.52 18.34,48.52
N$9
  Top 0.203: D6.A R8.1
N$10
  Top 0.203: D4.A R4.1
N$11
  Top 0.203: C17.2 10.54,55.42 U6.6
N$12
  Top 0.203: U6.2 13.74,56.08 J8.FEED
N$13
  Top 0.203: C16.2 9.84,56.94 10.05,56.73 U6.4
RXI-0  (via drill 0.2)
  Top 0.127: v8.18,47.88
  Top 0.152: U3.D3 v8.18,47.88
  Top 0.203: 12.95,35.99 12.19,35.99 TP2.P$1 | U4.8 17.02,34.1 14.82,36.3 12.95,36.3 12.95,35.99 | D6.C 12.95,35.99
  Route2 0.127: v8.18,47.88 8.18,46.71 8.38,46.51 12.62,46.51 12.62,36.43 TP2.P$1
SHLD  (via drill 0.3)
  other vias: 11.43,2.54
  pour Bottom: 16.13,0 6.73,0 6.73,6.35 16.13,6.35
  pour Top: 16.13,0 6.73,0 6.73,6.35 16.13,6.35
SWDCK  (via drill 0.2 pad 0.4)
  Top 0.127: U3.C2
  Top 0.152: v6.83,49.23 U3.C2
  Route2 0.127: v6.83,49.23 6.83,48.72 5.84,47.73 5.84,41.96 7.67,40.13 7.67,38.46 7.11,37.89 J2.4
SWDIO  (via drill 0.2)
  Top 0.127: 9.51,43.81 9.5,43.81 9.5,43.82 v9.51,43.83
  Top 0.152: U3.G5 9.51,43.81
  Route15 0.127: v9.51,43.83 8.84,43.16 8.84,41.05 6.95,39.16 J2.2
TXO-0  (via drill 0.2)
  Top 0.127: U3.J7 12.93,41.78 | 14.5,34.81 D5.C
  Top 0.152: 12.93,41.78 v12.93,41.07
  Top 0.203: U4.9 16.52,34.09 15.81,34.8 TP3.P$1 15.48,34.79 D5.C
  Route2 0.127: v12.93,41.07 12.93,37.72 15.49,35.15 TP3.P$1
V_BATT  (via drill 0.3)
  Top 0.762: J3.1 2.6,24.13 4.32,22.42 v4.32,21.59 4.32,19.3 4.84,18.78 J1.2 11.12,18.78 D2.A | U1.3 7.05,27.43 v6.86,27.62 C3.1
  Bottom 0.762: v6.86,27.62 6.86,24.38 4.32,21.84 v4.32,21.59
V_LORA  (via drill 0.2)  (1 unrouted)
  Top 0.127: 6.84,42.48 v6.83,42.48
  Top 0.152: U3.H2 6.86,42.44
  Top 0.203: v13.08,27.2 C13.2 14.42,27.2 U5.5
  Route2 0.15: 10.73,41.95 10.87,41.81
  Route2 0.152: 10.73,41.95 7.36,41.95 v6.83,42.48 | 10.87,41.81 10.87,31.22
  Route2 0.203: v13.08,27.2 13.08,29.01 10.87,31.22
V_USB  (via drill 0.3, 0.35)
  Top 0.152: D1.A v9.91,35.79 v9.9,35.8 v9.9,35.79 | v5.35,32 3.17,32
  Top 0.203: 2.86,28.83 3.17,29.15 3.17,32
  Top 0.508: J5.VBUS1 8.98,5.75 9.65,5.08 v10.16,5.08 13.34,5.08 13.88,5.62 J5.VBUS2
  Top 0.762: J3.3 2.48,29.21 2.86,28.83 3.43,28.26 3.43,26.8 | 7.05,24.04 6.18,24.04 | 7.05,24.04 U1.4 | v8,23.97 7.93,24.04 7.05,24.04 | D3.A 11.3,15.8 10.7,15.21 v9.05,15.21
  Top 0.813: 6.18,24.04 5.36,24.04 4.54,24.86 | 4.54,24.86 3.43,25.97 3.43,26.8 | 4.54,24.86 4.54,25.03 C2.1
  Bottom 0.152: v9.9,35.79 9.9,35.45 6.45,32 v5.35,32
  Bottom 0.762: v8,23.97 8,16.26 v9.05,15.21 10.29,13.97 10.29,9.59 9.34,8.64 9.34,5.91 v10.16,5.08
VIN
  Top 0.203: R3.2 14.77,23.85 U5.1 | C4.1 13.67,22.55 C1.2
  Top 0.508: 10.35,22.92 U2.1
  Top 0.762: D3.C D2.C 13.6,18.92 12.13,20.38 12.13,22.47 | R3.2 C4.1 12.13,22.47 | 12.13,22.47 10.8,22.47 10.35,22.92
~D0/RXI-1  (via drill 0.2)
  Top 0.127: v14.93,47.88
  Top 0.152: U3.D8 v14.93,47.88
  Route15 0.127: v14.93,47.88 16.68,47.88 17.58,46.99 J4.14
~D1/TXO-1  (via drill 0.2)
  Top 0.127: v16.23,53.24
  Top 0.152: U3.A9 v16.23,53.24
  Route2 0.127: v16.23,53.24 18.11,53.24 19.99,51.36 19.99,50.6 21.06,49.53 J4.15
~D2  (via drill 0.2)
  Top 0.127: v14.25,53.31
  Top 0.152: U3.A8 v14.25,53.31
  Route2 0.127: v14.25,53.31 14.58,53.65 18.31,53.65 19.89,52.07 J4.16
~D3/A6  (via drill 0.2)
  Top 0.152: U3.E7 v12.23,47.87
  Route15 0.102: v12.23,47.87 9.08,47.87 8.13,46.91 1.35,46.91 J3.10
~D4  (via drill 0.2)
  Top 0.127: 4.1,47.21 v4.09,47.19
  Top 0.152: U3.E1 4.1,47.21
  Route2 0.127: v4.09,47.19 2.77,47.19 2.39,46.81 2.39,45.26 1.57,44.45 J3.9
~D5  (via drill 0.2)
  Top 0.127: 5.44,49.27 5.44,49.28 v5.47,49.24
  Top 0.152: U3.D2 5.44,49.27
  Route2 0.127: v5.47,49.24 4.27,48.04 4.27,47.07 3.96,46.76 3.05,46.76 2.69,46.41 2.69,44.3 2.52,44.12 2.52,42.34 2.54,42.32 2.13,41.91 J3.8
~D6  (via drill 0.2)
  Top 0.127: 5.44,45.15 5.44,45.14 v5.47,45.17 | v5.47,45.17
  Top 0.152: U3.F2 5.44,45.15
  Route2 0.127: v5.47,45.17 3.26,45.17 3.02,44.93 3.02,41.91 2.41,41.3 2.41,40.03 1.75,39.37 J3.7
~D7  (via drill 0.2)
  Top 0.127: 6.81,46.52 6.81,46.51 v6.84,46.55
  Top 0.203: U3.E3 6.81,46.52
  Route15 0.127: v6.84,46.55 3.37,46.55 2.52,45.7 2.52,37.36 1.98,36.83 J3.6
~D8  (via drill 0.2)
  Top 0.127: 8.13,43.79 v8.17,43.83
  Top 0.152: U3.G4 8.13,43.79
  Route15 0.127: v8.17,43.83 3.14,43.83 2.85,43.54 2.85,36.63 2.52,36.3 2.52,34.87 1.93,34.29 J3.5
~D9/A7  (via drill 0.2)
  Top 0.127: U3.G6 11.55,44.49 | 10.83,43.79 10.82,43.79 v10.86,43.83
  Top 0.152: U3.G6 10.83,43.79
  Route15 0.127: v10.86,43.83 9.86,42.82 9.86,41.48 7.59,39.22 7.59,36.91 | J2.6 6.41,36.9 7.59,36.9 7.59,36.91 | 7.59,36.91 7.59,33.4 7.44,33.25 2.79,33.25 2.44,32.89 2.44,32.44 1.75,31.75 J3.4
~D11/MOSI
  Top 0.127: 21.39,41.71 J4.12
  Top 0.152: U3.H9 16.34,42.42 16.74,42.42 17.45,41.71 21.39,41.71
~D12/MISO  (via drill 0.2)
  Top 0.127: 8.2,45.21 8.2,45.2 v8.18,45.18
  Top 0.152: U3.G3 8.2,45.21
  Route15 0.127: v8.18,45.18 8.18,46.36 8.36,46.53 18.03,46.53 20.12,44.45 J4.13
~D13/SCK  (via drill 0.2)
  Top 0.127: U3.J8 14.28,41.78
  Top 0.152: 14.28,41.78 v14.28,41.07
  Route15 0.127: v14.28,41.07 14.73,40.62 19.58,40.62 20.3,39.9 20.3,39.42 20.34,39.37 J4.11
~D15/QWIIC_SCL  (via drill 0.2)
  Top 0.127: U3.J5 10.21,41.79
  Top 0.152: 10.21,41.79 v10.21,41.07 | 5.05,7.92 J6.4
  Top 0.203: TP4.P$1 5.05,7.92
  Route2 0.203: v10.21,41.07 8.41,39.27 8.41,33.43 6.48,31.5 4.19,31.5 3.45,30.76 3.45,25.02 3.83,24.64 3.83,8.05 TP4.P$1
~D16/SDA1
  Top 0.127: 5.49,47.87 5.49,47.88
  Top 0.152: U3.E2 5.49,47.87 | J3.12 2.49,50.85 2.49,49.33 3.94,47.88 5.49,47.88
~D17/SCL1
  Top 0.152: U3.F1 4,45.86 2.39,47.47 2.39,48.62 1.47,49.53 J3.11
~D18/LED  (via drill 0.2)
  Top 0.127: v6.83,45.19
  Top 0.152: U3.F3 v6.83,45.19
  Top 0.203: v8.38,28.7 R12.2
  Route15 0.152: v6.83,45.19 6.83,44.75 6.93,44.65 10.97,44.65 12.62,43 12.62,38.38 10.85,36.6 10.85,29.52 10.03,28.7 v8.38,28.7
~D19/A0  (via drill 0.2)
  Top 0.127: 14.94,43.82 14.94,43.81 v14.93,43.83
  Top 0.152: U3.G8 14.94,43.82
  Route2 0.127: v14.93,43.83 18.38,43.83 19.05,43.16 19.05,29.52 19.74,28.83 19.74,24.84 20.45,24.13 J4.5
~D20/A1  (via drill 0.2)
  Top 0.127: U3.G9 v16.35,44.51 v16.36,44.5
  Route2 0.127: v16.36,44.5 18.49,44.5 19.33,43.66 19.33,29.59 20.12,28.8 20.12,27.1 20.55,26.67 J4.6
~D21/A2  (via drill 0.2)
  Top 0.127: 13.59,45.16 13.58,45.17 v13.58,45.18
  Top 0.152: U3.F7 13.59,45.16
  Route15 0.127: v13.58,45.18 13.58,40.57 13.95,40.21 18.26,40.21 20.02,38.46 20.02,29.54 20.42,29.13 21.51,29.13 J4.7
~D22/A3  (via drill 0.2)  (1 unrouted)
  Top 0.152: U3.F8 14.94,45.17
  Route2 0.127: v14.93,45.18 19.03,45.18 19.63,44.58 19.63,32.46 20.34,31.75 J4.8
~D23/A4  (via drill 0.2)  (1 unrouted)
  Top 0.127: 13.54,47.93 13.56,47.9 v13.56,47.88
  Top 0.152: U3.E8 13.54,47.92
  Route2 0.127: v13.56,47.88 | v13.56,47.88 13.56,46.74 13.77,46.53 18.8,46.53 19.91,45.41 19.91,34.87 20.5,34.29 J4.9
~D24/A5  (via drill 0.2)
  Top 0.127: U3.B9
  Top 0.152: U3.B9 v16.31,51.26
  Route2 0.127: v16.31,51.26 18.06,51.26 20.17,49.15 20.17,37.69 21.03,36.83 J4.10

### Text on the board
Bottom: v10
tDocu: Daniel Dobre